# EAGLE design homeboard1 (EAGLE 6.0)
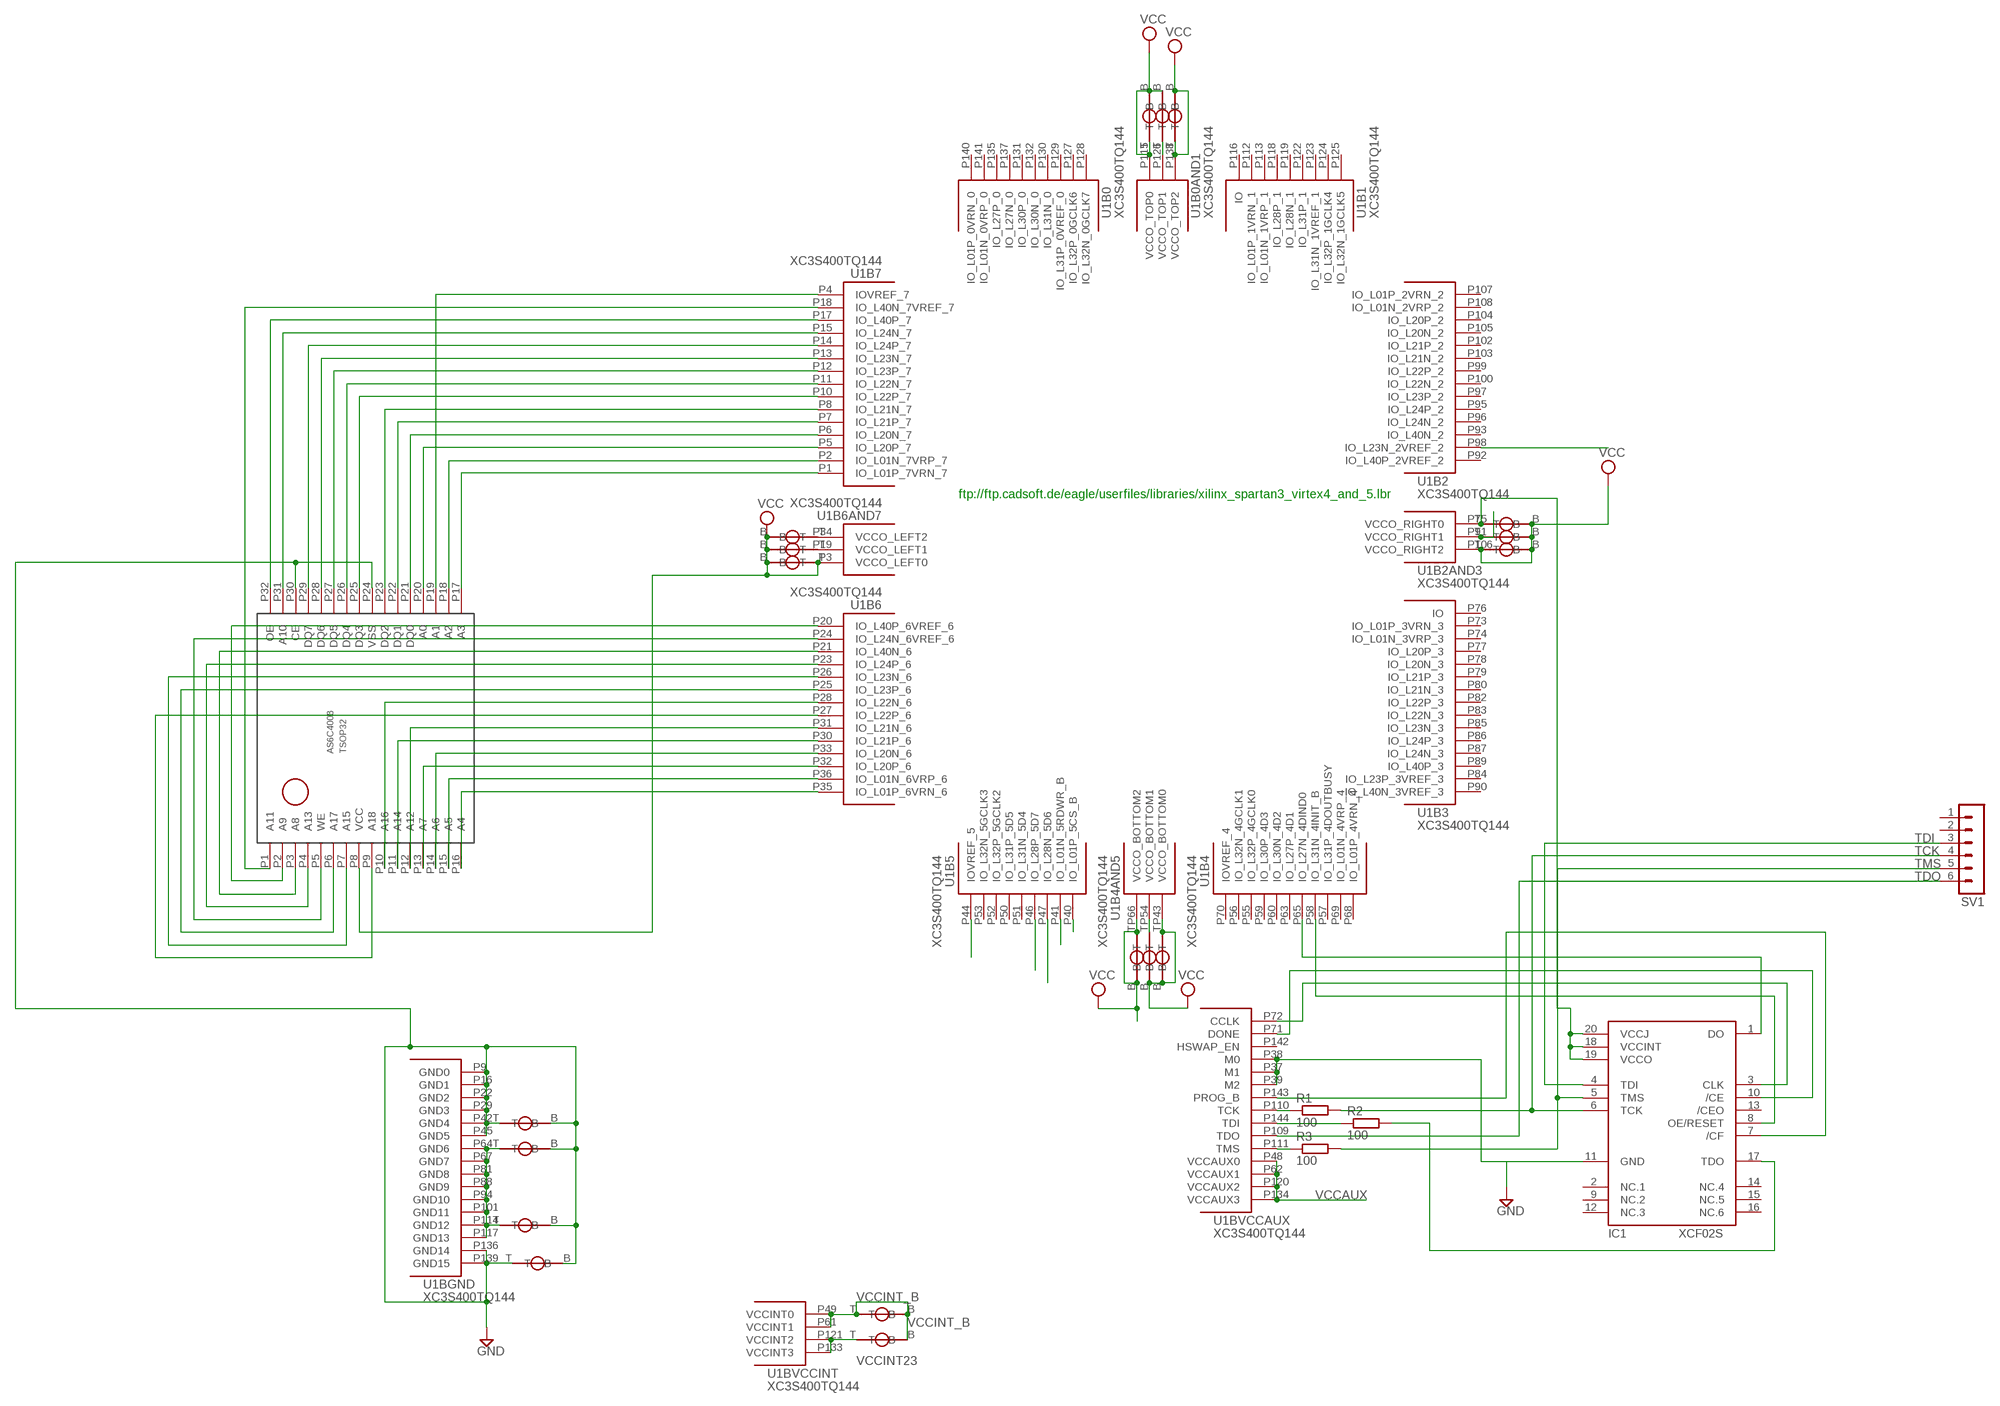
[diagram p0: schematic, sheet 1]

## Parts
IC1  XCF02S  [VO20]
R1  100  R-EU_R0805  [R0805]
R2  100  R-EU_R0805  [R0805]
R3  100  R-EU_R0805  [R0805]
SV1  MA06-1  [MA06-1]
U1  XC3S400TQ144  [TQ144]
U$1  VIA_DIY  [VIA_DIY]
U$2  VIA_DIY  [VIA_DIY]
U$3  VIA_DIY  [VIA_DIY]
U$4  AS6C4008  [TSOP32]
U$5  VIA_DIY  [VIA_DIY]
U$6  VIA_DIY  [VIA_DIY]
U$7  VIA_DIY  [VIA_DIY]
U$10  VIA_DIY  [VIA_DIY]
U$14  VIA_DIY  [VIA_DIY]
U$15  VIA_DIY  [VIA_DIY]
U$18  VIA_DIY  [VIA_DIY]
U$19  VIA_DIY  [VIA_DIY]
U$20  VIA_DIY  [VIA_DIY]
U$23  VIA_DIY  [VIA_DIY]
U$25  VIA_DIY  [VIA_DIY]
U$26  VIA_DIY  [VIA_DIY]
U$27  VIA_DIY  [VIA_DIY]
U$28  VIA_DIY  [VIA_DIY]
U$29  VIA_DIY  [VIA_DIY]

## Nets
GND: IC1.11(GND) U1.P9(BGND:GND0) U1.P16(BGND:GND1) U1.P22(BGND:GND2) U1.P29(BGND:GND3) U1.P37(BVCCAUX:M1) U1.P38(BVCCAUX:M0) U1.P39(BVCCAUX:M2) U1.P42(BGND:GND4) U1.P45(BGND:GND5) U1.P136(BGND:GND14) U1.P139(BGND:GND15) U$2.B U$3.B U$3.T U$4.P24(VSS) U$4.P30(CE) U$5.B U$5.T U$20.B
N$1: U1.P1(B7:IO_L01P_7VRN_7) U$4.P17(A3)
N$2: U1.P2(B7:IO_L01N_7VRP_7) U$4.P18(A2)
N$3: U1.P126(B0AND1:VCCO_TOP1) U$10.T
N$4: U1.P64(BGND:GND6) U1.P67(BGND:GND7) U1.P81(BGND:GND8) U1.P88(BGND:GND9) U1.P94(BGND:GND10) U1.P101(BGND:GND11) U1.P114(BGND:GND12) U1.P117(BGND:GND13) U$2.T U$20.T
N$5: U1.P12(B7:IO_L23P_7) U$4.P27(DQ5)
N$6: U1.P13(B7:IO_L23N_7) U$4.P28(DQ6)
N$7: U1.P6(B7:IO_L20N_7) U$4.P21(DQ0)
N$8: R1.1 U1.P110(BVCCAUX:TCK)
N$9: IC1.1(DO) U1.P65(B4:IO_L27N_4DIND0)
N$10: U1.P7(B7:IO_L21P_7) U$4.P22(DQ1)
N$11: U1.P8(B7:IO_L21N_7) U$4.P23(DQ2)
N$12: R2.1 U1.P144(BVCCAUX:TDI)
N$13: IC1.17(TDO) R2.2
N$14: U1.P34(B6AND7:VCCO_LEFT2) U$14.T
N$15: U1.P19(B6AND7:VCCO_LEFT1) U$15.T
N$16: R3.1 U1.P111(BVCCAUX:TMS)
N$17: IC1.7(/CF) U1.P143(BVCCAUX:PROG_B)
N$18: IC1.8(OE/RESET) U1.P58(B4:IO_L31N_4INIT_B)
N$19: IC1.3(CLK) U1.P72(BVCCAUX:CCLK)
N$20: IC1.10(/CE) U1.P71(BVCCAUX:DONE)
N$21: U1.P98(B2:IO_L23N_2VREF_2)
N$22: U1.P10(B7:IO_L22P_7) U$4.P25(DQ3)
N$23: U1.P11(B7:IO_L22N_7) U$4.P26(DQ4)
N$24: U1.P14(B7:IO_L24P_7) U$4.P29(DQ7)
N$25: U1.P54(B4AND5:VCCO_BOTTOM1) U$25.T
N$26: IC1.18(VCCINT) IC1.19(VCCO) IC1.20(VCCJ) U1.P75(B2AND3:VCCO_RIGHT0) U$29.T
N$27: U1.P15(B7:IO_L24N_7) U$4.P31(A10)
N$28: U1.P91(B2AND3:VCCO_RIGHT1) U$28.T
N$29: U1.P17(B7:IO_L40P_7) U$4.P32(OE)
N$30: U1.P28(B6:IO_L22N_6) U$4.P10(A16)
N$31: U1.P30(B6:IO_L21P_6) U$4.P11(A14)
N$32: U1.P31(B6:IO_L21N_6) U$4.P12(A12)
N$33: U1.P20(B6:IO_L40P_6VREF_6) U$4.P2(A9)
N$34: U1.P32(B6:IO_L20P_6) U$4.P13(A7)
N$35: U1.P33(B6:IO_L20N_6) U$4.P14(A6)
N$36: U1.P27(B6:IO_L22P_6) U$4.P9(A18)
N$37: U1.P35(B6:IO_L01P_6VRN_6) U$4.P16(A4)
N$38: U1.P36(B6:IO_L01N_6VRP_6) U$4.P15(A5)
N$43: U1.P40(B5:IO_L01P_5CS_B)
N$44: U1.P41(B5:IO_L01N_5RDWR_B)
N$45: U1.P44(B5:IOVREF_5)
N$46: U1.P46(B5:IO_L28P_5D7)
N$47: U1.P47(B5:IO_L28N_5D6)
N$48: U1.P5(B7:IO_L20P_7) U$4.P20(A0)
N$49: U1.P4(B7:IOVREF_7) U$4.P19(A1)
N$50: U1.P18(B7:IO_L40N_7VREF_7) U$4.P1(A11)
N$52: U1.P23(B6:IO_L24P_6) U$4.P4(A13)
N$53: U1.P21(B6:IO_L40N_6) U$4.P3(A8)
N$54: U1.P24(B6:IO_L24N_6VREF_6) U$4.P5(WE)
N$55: U1.P25(B6:IO_L23P_6) U$4.P6(A17)
N$56: U1.P26(B6:IO_L23N_6) U$4.P7(A15)
TCK: IC1.6(TCK) R1.2 SV1.4
TDI: IC1.4(TDI) SV1.3
TDO: SV1.6 U1.P109(BVCCAUX:TDO)
TMS: IC1.5(TMS) R3.2 SV1.5
VCC: U1.P3(B6AND7:VCCO_LEFT0) U1.P43(B4AND5:VCCO_BOTTOM0) U1.P66(B4AND5:VCCO_BOTTOM2) U1.P106(B2AND3:VCCO_RIGHT2) U1.P115(B0AND1:VCCO_TOP0) U1.P138(B0AND1:VCCO_TOP2) U$4.P8(VCC) U$6.B U$6.T U$7.B U$7.T U$10.B U$14.B U$15.B U$18.B U$18.T U$19.B U$19.T U$25.B U$26.B U$26.T U$27.B U$27.T U$28.B U$29.B
VCCAUX: U1.P48(BVCCAUX:VCCAUX0) U1.P62(BVCCAUX:VCCAUX1) U1.P120(BVCCAUX:VCCAUX2) U1.P134(BVCCAUX:VCCAUX3)
VCCINT23: U1.P121(BVCCINT:VCCINT2) U1.P133(BVCCINT:VCCINT3) U$23.T
VCCINT_B: U1.P49(BVCCINT:VCCINT0) U1.P61(BVCCINT:VCCINT1) U$1.B U$1.T U$23.B
Unconnected: IC1.2(NC.1) IC1.9(NC.2) IC1.12(NC.3) IC1.13(/CEO) IC1.14(NC.4) IC1.15(NC.5) IC1.16(NC.6) SV1.1 SV1.2 U1.P50(B5:IO_L31P_5D5) U1.P51(B5:IO_L31N_5D4) U1.P52(B5:IO_L32P_5GCLK2) U1.P53(B5:IO_L32N_5GCLK3) U1.P55(B4:IO_L32P_4GCLK0) U1.P56(B4:IO_L32N_4GCLK1) U1.P57(B4:IO_L31P_4DOUTBUSY) U1.P59(B4:IO_L30P_4D3) U1.P60(B4:IO_L30N_4D2) U1.P63(B4:IO_L27P_4D1) U1.P68(B4:IO_L01P_4VRN_4) U1.P69(B4:IO_L01N_4VRP_4) U1.P70(B4:IOVREF_4) U1.P73(B3:IO_L01P_3VRN_3) U1.P74(B3:IO_L01N_3VRP_3) U1.P76(B3:IO) U1.P77(B3:IO_L20P_3) U1.P78(B3:IO_L20N_3) U1.P79(B3:IO_L21P_3) U1.P80(B3:IO_L21N_3) U1.P82(B3:IO_L22P_3) U1.P83(B3:IO_L22N_3) U1.P84(B3:IO_L23P_3VREF_3) U1.P85(B3:IO_L23N_3) U1.P86(B3:IO_L24P_3) U1.P87(B3:IO_L24N_3) U1.P89(B3:IO_L40P_3) U1.P90(B3:IO_L40N_3VREF_3) U1.P92(B2:IO_L40P_2VREF_2) U1.P93(B2:IO_L40N_2) U1.P95(B2:IO_L24P_2) U1.P96(B2:IO_L24N_2) U1.P97(B2:IO_L23P_2) U1.P99(B2:IO_L22P_2) U1.P100(B2:IO_L22N_2) U1.P102(B2:IO_L21P_2) U1.P103(B2:IO_L21N_2) U1.P104(B2:IO_L20P_2) U1.P105(B2:IO_L20N_2) U1.P107(B2:IO_L01P_2VRN_2) U1.P108(B2:IO_L01N_2VRP_2) U1.P112(B1:IO_L01P_1VRN_1) U1.P113(B1:IO_L01N_1VRP_1) U1.P116(B1:IO) U1.P118(B1:IO_L28P_1) U1.P119(B1:IO_L28N_1) U1.P122(B1:IO_L31P_1) U1.P123(B1:IO_L31N_1VREF_1) U1.P124(B1:IO_L32P_1GCLK4) U1.P125(B1:IO_L32N_1GCLK5) U1.P127(B0:IO_L32P_0GCLK6) U1.P128(B0:IO_L32N_0GCLK7) U1.P129(B0:IO_L31P_0VREF_0) U1.P130(B0:IO_L31N_0) U1.P131(B0:IO_L30P_0) U1.P132(B0:IO_L30N_0) U1.P135(B0:IO_L27P_0) U1.P137(B0:IO_L27N_0) U1.P140(B0:IO_L01P_0VRN_0) U1.P141(B0:IO_L01N_0VRP_0) U1.P142(BVCCAUX:HSWAP_EN)

## Notes on the sheet
- ftp://ftp.cadsoft.de/eagle/userfiles/libraries/xilinx_spartan3_virtex4_and_5.lbr

## Library data of the parts
IC1 = smd-special:XCF02S
R1-R3 = rcl:R-EU_: RESISTOR, European symbol
SV1 = con-lstb:MA06-1: PIN HEADER; OC_FARNELL: unknown; OC_NEWARK: unknown
U1 = xilinx_spartan3_virtex4_and_5:XC3S400TQ144: Xilinx FPGA
U$1-U$3 U$5-U$7 U$10 U$14 U$15 U$18-U$20 U$23 U$25-U$29 = cpcfpga:VIA_DIY
U$4 = cpcfpga:AS6C4008

## Board
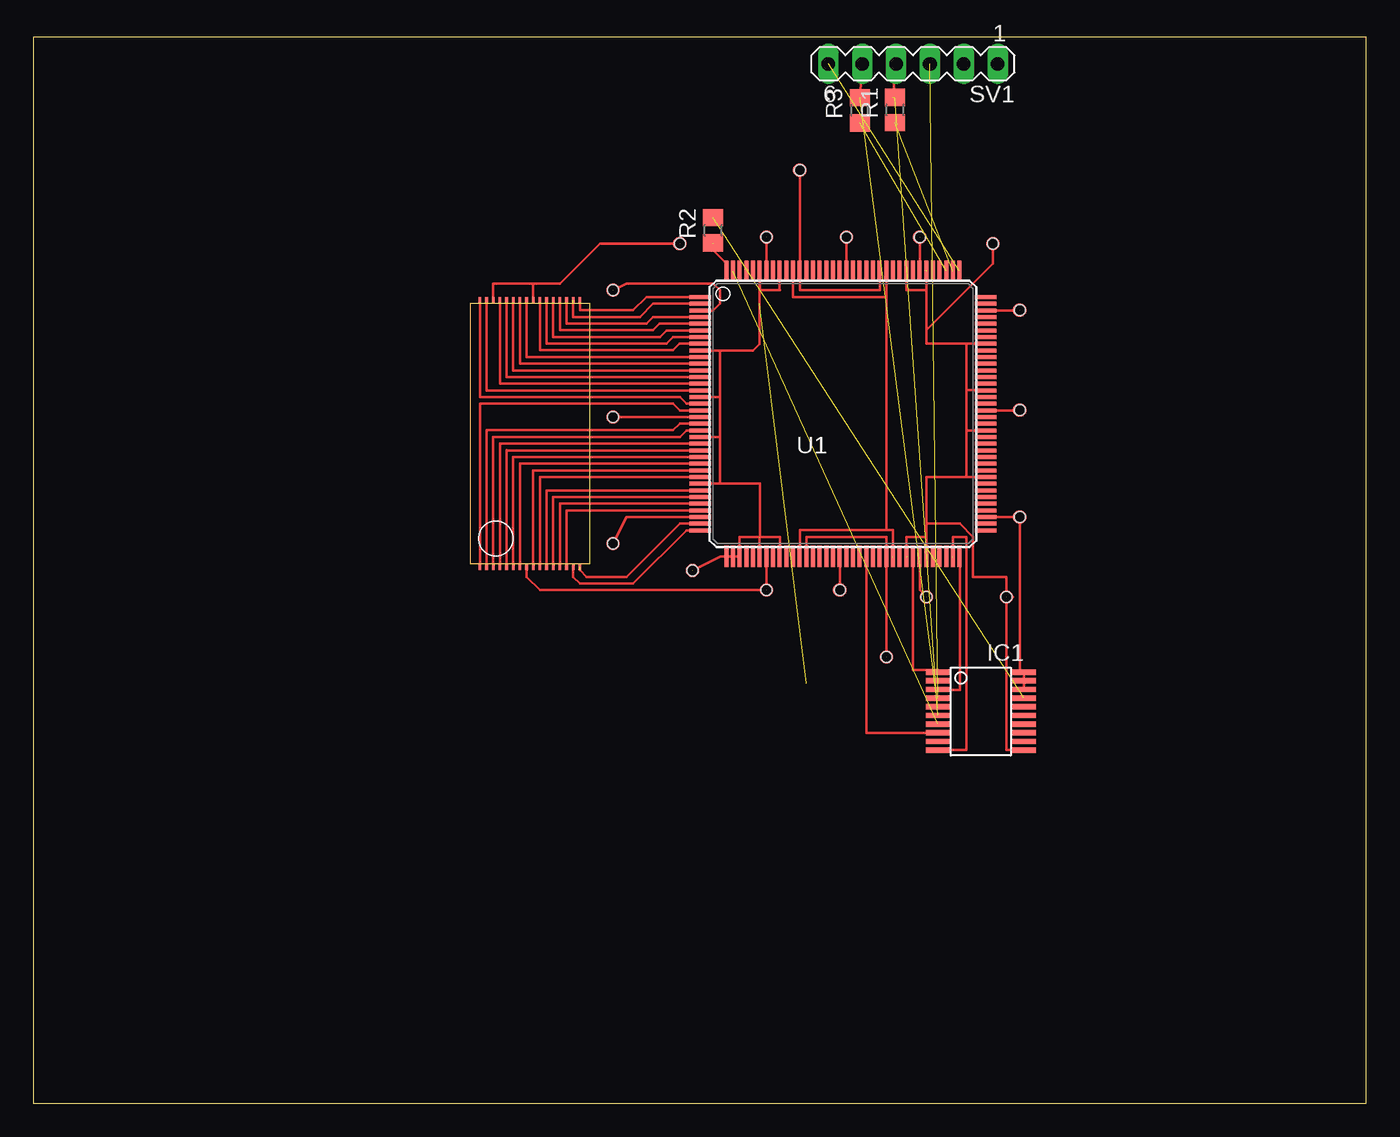
[diagram p1: board, top side]
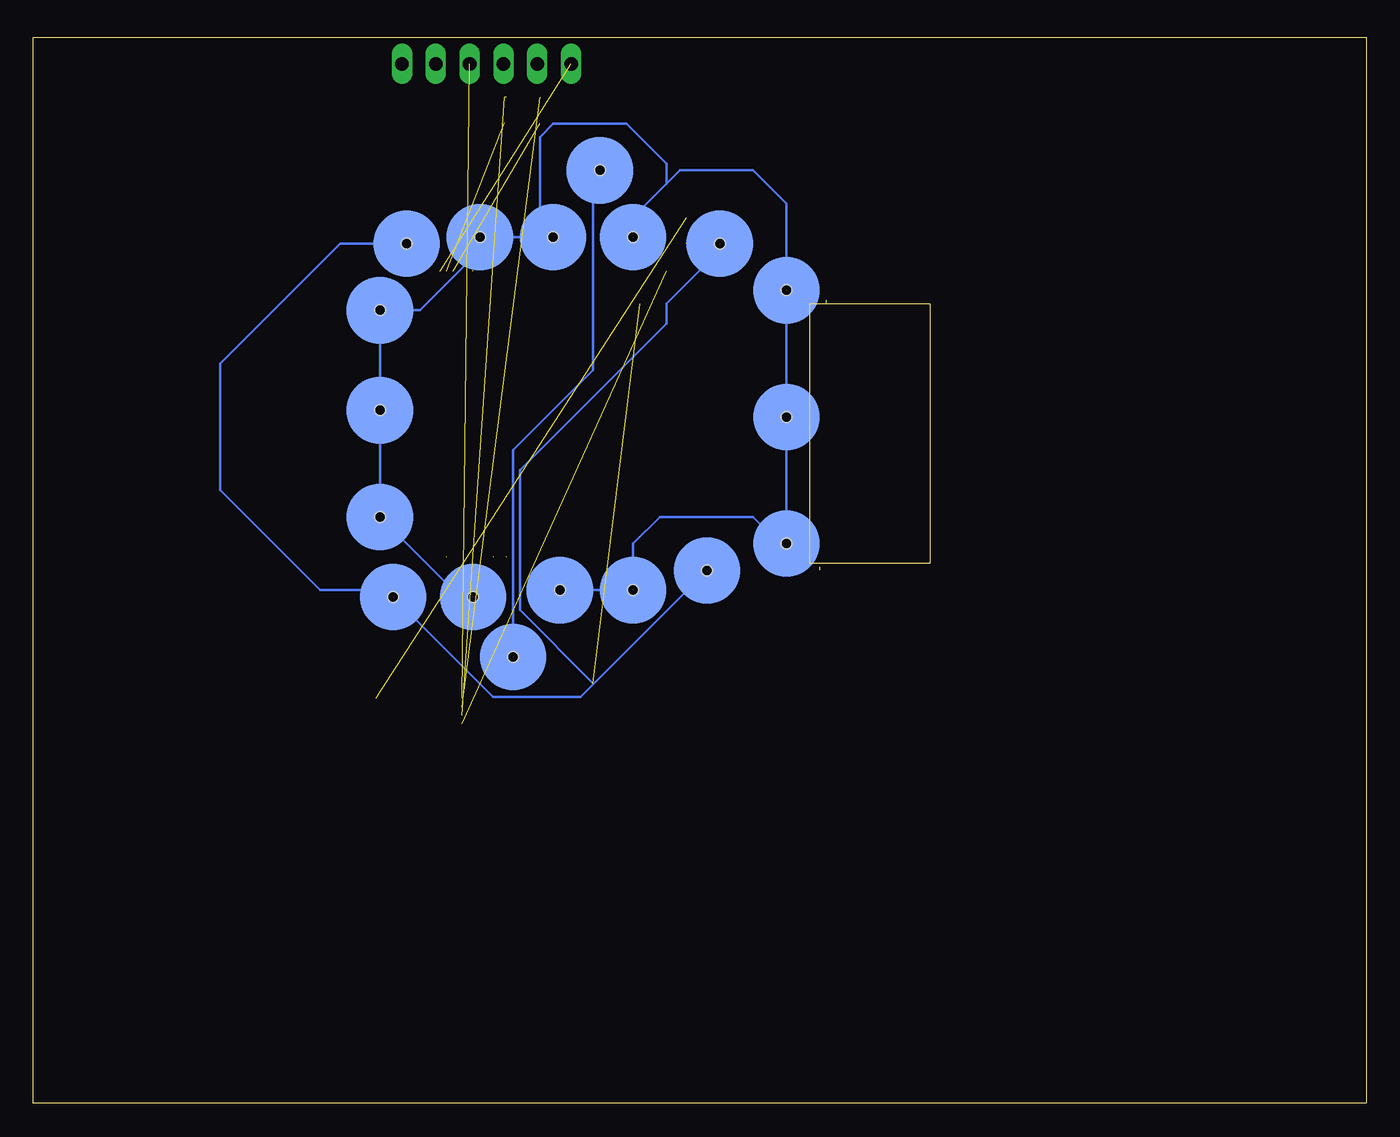
[diagram p2: board, bottom side, seen from below]

Size 100 x 80 mm. Coordinates in mm from the lower left corner, seen from the top.
Outline: 0,0 100,0 100,80 0,80 0,0
Copper layers (1*16): Top 0.035mm / dielectric 1.5mm / Bottom 0.035mm
Design rules: minimum track width 10mil, minimum drill 24mil, track to track 8mil, track to pad 8mil, pad to pad 8mil, via to via 8mil, smd to smd 8mil, copper to edge 40mil, drill to drill 8mil, minimum pad ring 10mil, minimum via ring 8mil, stop-mask expansion 4mil, vias tented up to drill 0mil, thermal gap 10mil

### Footprints (pad centres in the part's own frame; a part is rotated, then mirrored left to right if it is on the bottom)
VO20 = smd 0.4 x 1.8: 1 5.85,6.15; 2 5.2,6.15; 3 4.55,6.15; 4 3.9,6.15; 5 3.25,6.15; 6 2.6,6.15; 7 1.95,6.15; 8 1.3,6.15; 9 0.65,6.15; 10 0,6.15; 11 0,-0.3; 12 0.65,-0.3; 13 1.3,-0.3; 14 1.95,-0.3; 15 2.6,-0.3; 16 3.25,-0.3; 17 3.9,-0.3; 18 4.55,-0.3; 19 5.2,-0.3; 20 5.85,-0.3
R0805 = smd 1.3 x 1.5: 1 -0.95,0; 2 0.95,0
MA06-1 = drill 1.016 long: 1 -6.35,0; 2 -3.81,0; 3 -1.27,0; 4 1.27,0; 5 3.81,0; 6 6.35,0
TQ144 = smd 1.6 x 0.3: P1 -10.7,8.75; P2 -10.7,8.25; P3 -10.7,7.75; P4 -10.7,7.25; P5 -10.7,6.75; P6 -10.7,6.25; P7 -10.7,5.75; P8 -10.7,5.25; P9 -10.7,4.75; P10 -10.7,4.25; P11 -10.7,3.75; P12 -10.7,3.25; P13 -10.7,2.75; P14 -10.7,2.25; P15 -10.7,1.75; P16 -10.7,1.25; P17 -10.7,0.75; P18 -10.7,0.25; P19 -10.7,-0.25; P20 -10.7,-0.75; P21 -10.7,-1.25; P22 -10.7,-1.75; P23 -10.7,-2.25; P24 -10.7,-2.75; P25 -10.7,-3.25; P26 -10.7,-3.75; P27 -10.7,-4.25; P28 -10.7,-4.75; P29 -10.7,-5.25; P30 -10.7,-5.75; P31 -10.7,-6.25; P32 -10.7,-6.75; P33 -10.7,-7.25; P34 -10.7,-7.75; P35 -10.7,-8.25; P36 -10.7,-8.75; P73 10.7,-8.75; P74 10.7,-8.25; P75 10.7,-7.75; P76 10.7,-7.25; P77 10.7,-6.75; P78 10.7,-6.25; P79 10.7,-5.75; P80 10.7,-5.25; P81 10.7,-4.75; P82 10.7,-4.25; P83 10.7,-3.75; P84 10.7,-3.25; P85 10.7,-2.75; P86 10.7,-2.25; P87 10.7,-1.75; P88 10.7,-1.25; P89 10.7,-0.75; P90 10.7,-0.25; P91 10.7,0.25; P92 10.7,0.75; P93 10.7,1.25; P94 10.7,1.75; P95 10.7,2.25; P96 10.7,2.75; P97 10.7,3.25; P98 10.7,3.75; P99 10.7,4.25; P100 10.7,4.75; P101 10.7,5.25; P102 10.7,5.75; P103 10.7,6.25; P104 10.7,6.75; P105 10.7,7.25; P106 10.7,7.75; P107 10.7,8.25; P108 10.7,8.75 | smd 0.3 x 1.6: P37 -8.75,-10.7; P38 -8.25,-10.7; P39 -7.75,-10.7; P40 -7.25,-10.7; P41 -6.75,-10.7; P42 -6.25,-10.7; P43 -5.75,-10.7; P44 -5.25,-10.7; P45 -4.75,-10.7; P46 -4.25,-10.7; P47 -3.75,-10.7; P48 -3.25,-10.7; P49 -2.75,-10.7; P50 -2.25,-10.7; P51 -1.75,-10.7; P52 -1.25,-10.7; P53 -0.75,-10.7; P54 -0.25,-10.7; P55 0.25,-10.7; P56 0.75,-10.7; P57 1.25,-10.7; P58 1.75,-10.7; P59 2.25,-10.7; P60 2.75,-10.7; P61 3.25,-10.7; P62 3.75,-10.7; P63 4.25,-10.7; P64 4.75,-10.7; P65 5.25,-10.7; P66 5.75,-10.7; P67 6.25,-10.7; P68 6.75,-10.7; P69 7.25,-10.7; P70 7.75,-10.7; P71 8.25,-10.7; P72 8.75,-10.7; P109 8.75,10.7; P110 8.25,10.7; P111 7.75,10.7; P112 7.25,10.7; P113 6.75,10.7; P114 6.25,10.7; P115 5.75,10.7; P116 5.25,10.7; P117 4.75,10.7; P118 4.25,10.7; P119 3.75,10.7; P120 3.25,10.7; P121 2.75,10.7; P122 2.25,10.7; P123 1.75,10.7; P124 1.25,10.7; P125 0.75,10.7; P126 0.25,10.7; P127 -0.25,10.7; P128 -0.75,10.7; P129 -1.25,10.7; P130 -1.75,10.7; P131 -2.25,10.7; P132 -2.75,10.7; P133 -3.25,10.7; P134 -3.75,10.7; P135 -4.25,10.7; P136 -4.75,10.7; P137 -5.25,10.7; P138 -5.75,10.7; P139 -6.25,10.7; P140 -6.75,10.7; P141 -7.25,10.7; P142 -7.75,10.7; P143 -8.25,10.7; P144 -8.75,10.7
VIA_DIY = smd 5 x 5 bottom: B 0,0 | smd 1 x 1: T 0,0 | hole 0.8: 0,0
TSOP32 = smd 0.5 x 0.2: P1 -9.75,3.75; P2 -9.75,3.25; P3 -9.75,2.75; P4 -9.75,2.25; P5 -9.75,1.75; P6 -9.75,1.25; P7 -9.75,0.75; P8 -9.75,0.25; P9 -9.75,-0.25; P10 -9.75,-0.75; P11 -9.75,-1.25; P12 -9.75,-1.75; P13 -9.75,-2.25; P14 -9.75,-2.75; P15 -9.75,-3.25; P16 -9.75,-3.75; P17 10.25,-3.75; P18 10.25,-3.25; P19 10.25,-2.75; P20 10.25,-2.25; P21 10.25,-1.75; P22 10.25,-1.25; P23 10.25,-0.75; P24 10.25,-0.25; P25 10.25,0.25; P26 10.25,0.75; P27 10.25,1.25; P28 10.25,1.75; P29 10.25,2.25; P30 10.25,2.75; P31 10.25,3.25; P32 10.25,3.75

### Placement (x,y rotation side)
IC1  74,26.5 90 top
R1  64.66,74.53 90 top
R2  51,65.5 90 top
R3  62,74.5 90 top
SV1  66,78 180 top
U1  60.74,51.74 0 top
U$1  64,33.5 0 top
U$2  73,38 0 top
U$3  48.5,64.5 0 top
U$4  37.25,50 90 top
U$5  49.47,39.97 0 top
U$6  55,65 0 top
U$7  66.5,65 0 top
U$10  61,65 0 top
U$14  43.5,42 0 top
U$15  43.5,51.5 0 top
U$18  43.5,61 0 top
U$19  67,38 0 top
U$20  72,64.5 0 top
U$23  57.5,70 0 top
U$25  60.5,38.5 0 top
U$26  55,38.5 0 top
U$27  74,59.5 0 top
U$28  74,52 0 top
U$29  74,44 0 top

### Tracks (layer width: path | path; a pad name or v marks a point on that pad's centre or on a via)
GND  (5 unrouted)
  Top 0.2: U1.P45 56,42.5 54.5,42.5 | 54.49,42.5 U1.P42 | U1.P9 51.5,56.49 | 51.5,56.49 51.5,53 | U1.P16 51.5,53 | 51.5,53 51.5,50 | 51.5,50 U1.P22 | U1.P29 51.5,46.49 51.5,46.5 | 51.5,46.5 51.5,50 | 54.5,42.5 54.5,46.5 51.5,46.5 | 51.5,56.49 54,56.49 54.49,56.98 U1.P139 54.5,61 56,61 55.99,61.01 U1.P136 | IC1.11 73,26.5 U$2.B 73.5,38 | U$5.B 51.54,41.04 U1.P37 U1.P38 U1.P39 52.99,42.49 53,42.5 54.5,42.5 | U$4.P24 37.5,61.5 | U$4.P30 34.5,61.5 37.5,61.5 | U$3.B 42.5,64.5 39.5,61.5 37.5,61.5
  Bottom 0.2: U$20.B 77,64.5 86,55.5 86,46 78.5,38.5 73.5,38.5 U$2.B 65.5,30.5 58.94,30.5 U$5.B | U$3.B 48.5,64 52.5,60 52.5,58.5 63.5,47.5 63.5,37 58,31.5
N$1
  Top 0.2: U1.P1 45.99,60.49 45,59.5 41,59.5 U$4.P17
N$2  (1 unrouted)
  Top 0.2: U1.P2 46.49,59.99 45.5,59 40.5,59 40.5,60
N$3
  Top 0.2: U1.P126 U$10.T
N$4  (2 unrouted)
  Top 0.2: U1.P117 65.5,61 67,61 67,62.5 | U1.P114 67,58 | 67,58 67,57 U1.P101 70,56.99 70,53.5 | 70,53.5 U1.P94 | U1.P88 70,50.49 | 70,50.49 70,53.5 | U1.P81 70,46.99 70,47 | 70,47 70,50.49 | 67,42.5 67,43.5 | 67,43.5 67,47 70,47 | U1.P67 67,42.5 | 67,42.5 65.5,42.5 65.5,41 | U$2.T 73,39.5 70.5,39.5 70.5,42.5 69.5,43.5 67,43.5 | U$20.T 72,63 67,58
N$5
  Top 0.2: U1.P12 36,54.99 U$4.P27
N$6
  Top 0.2: U1.P13 35.5,54.49 U$4.P28
N$7
  Top 0.2: U1.P6 47.49,57.99 47,57.5 39,57.5 U$4.P21
N$8  (1 unrouted)
N$9
  Top 0.2: U1.P65 66,32.5 67.85,32.5 IC1.1
N$10
  Top 0.2: U1.P7 47.99,57.49 47.5,57 38.5,57 U$4.P22
N$11
  Top 0.2: U1.P8 48.49,56.99 48,56.5 38,56.5 U$4.P23
N$12  (1 unrouted)
  Top 0.2: U1.P144 51.99,63.01 51,64 51,64.5
N$13  (1 unrouted)
N$14
  Top 0.2: U1.P34 44.5,43.99 U$14.T
N$15
  Top 0.2: U$15.T U1.P19
N$16  (1 unrouted)
N$17  (1 unrouted)
N$18
  Top 0.2: IC1.8 62.49,27.8 U1.P58
N$19
  Top 0.2: U1.P72 69.5,31 68,31 68,31.05 IC1.3
N$20  (1 unrouted)
  Top 0.2: IC1.10 70,26.5 70,42.5 69,42.5 69,41
N$22
  Top 0.2: U1.P10 37,55.99 U$4.P25
N$23
  Top 0.2: U1.P11 36.5,55.49 U$4.P26
N$24
  Top 0.2: U1.P14 35,53.99 U$4.P29
N$25
  Top 0.2: U1.P54 U$25.T
N$26
  Top 0.2: U1.P75 U$29.T 74,32.35 IC1.20 IC1.19 IC1.18
N$27
  Top 0.2: U1.P15 34,53.49 U$4.P31
N$28
  Top 0.2: U1.P91 U$28.T
N$29
  Top 0.2: U1.P17 49.01,52.49 48.5,53 33.5,53 U$4.P32
N$30
  Top 0.2: U1.P28 38,46.99 U$4.P10
N$31
  Top 0.2: U1.P30 38.5,45.99 U$4.P11
N$32
  Top 0.2: U1.P31 39,45.49 U$4.P12
N$33
  Top 0.2: U$4.P2 34,50.5 48,50.5 48.5,51 U1.P20
N$34
  Top 0.2: U1.P32 39.5,44.99 U$4.P13
N$35
  Top 0.2: U1.P33 40,44.49 U$4.P14
N$36
  Top 0.2: U1.P27 37.5,47.49 U$4.P9
N$37  (1 unrouted)
  Top 0.2: U1.P35 48.51,43.49 48.5,43.5 44.5,39.5 41.5,39.5 41,40
N$38
  Top 0.2: U1.P36 48.99,42.99 45,39 41,39 40.5,39.5 U$4.P15
N$48
  Top 0.2: U1.P5 46.99,58.49 46.5,58 39.5,58 U$4.P20
N$49
  Top 0.2: U1.P4 46.49,58.99 46,58.5 40,58.5 U$4.P19
N$50
  Top 0.2: U1.P18 48.51,51.99 48,52.5 33.5,52.5 U$4.P1
N$52
  Top 0.2: U1.P23 37.5,49.49 37.49,49.5 35,49.5 U$4.P4
N$53
  Top 0.2: U1.P21 48.99,50.49 48.5,50 34.5,50 U$4.P3
N$54
  Top 0.2: U1.P24 35.51,48.99 35.5,49 U$4.P5
N$55
  Top 0.2: U$4.P6 36,48.5 U1.P25
N$56
  Top 0.2: U1.P26 36.5,47.99 U$4.P7
TCK  (2 unrouted)
  Top 0.2: SV1.4 64.5,75.5
TDI  (1 unrouted)
TDO  (1 unrouted)
TMS  (2 unrouted)
  Top 0.2: SV1.5 62,75.5
VCC  (6 unrouted)
  Top 0.2: U1.P115 U$7.T | U1.P106 U$27.T | U1.P66 66.5,38.5 U$19.T | U1.P43 U$26.T 38,38.5 37,39.5 U$4.P8 | U1.P138 U$6.T | U1.P3 50.99,59.49 51.5,60 51.5,61 51,61.5 44.5,61.5 U$18.T
  Bottom 0.2: U$7.T U$10.B 62,66 62,72.5 61,73.5 55.5,73.5 52.5,70.5 52.5,69 | U$25.B U$26.T 55,42 53,44 46,44 44.5,42.5 U$14.B U$15.B U$18.T 43.5,67.5 46,70 51.5,70 52.5,69 | U$19.T 68.5,38.5 U$29.B U$28.B U$27.T 71,59.5 66.5,64 U$7.T | U$7.T 68.5,65 | U$6.T 55,66.5 52.5,69
VCCAUX  (1 unrouted)
  Top 0.2: U1.P48 57.5,43 64,43 | 64.5,41 64.5,43 64,43 | U1.P120 64,60.5 | 64,60.5 56.99,60.5 U1.P134 | 64,43 64,60.5
VCCINT23
  Top 0.2: U1.P121 63.5,61 57.5,61 U1.P133 | U1.P133 | U$23.T U1.P133
VCCINT_B  (1 unrouted)
  Top 0.2: U$1.T 63.99,34.01 64,34.01 U1.P61 | U1.P61 64,42.5 57.99,42.5 U1.P49 | U1.P61
  Bottom 0.2: U$1.T 64,49 58,55 58,70 U$23.B